# Altium project Board 3.PrjPcb
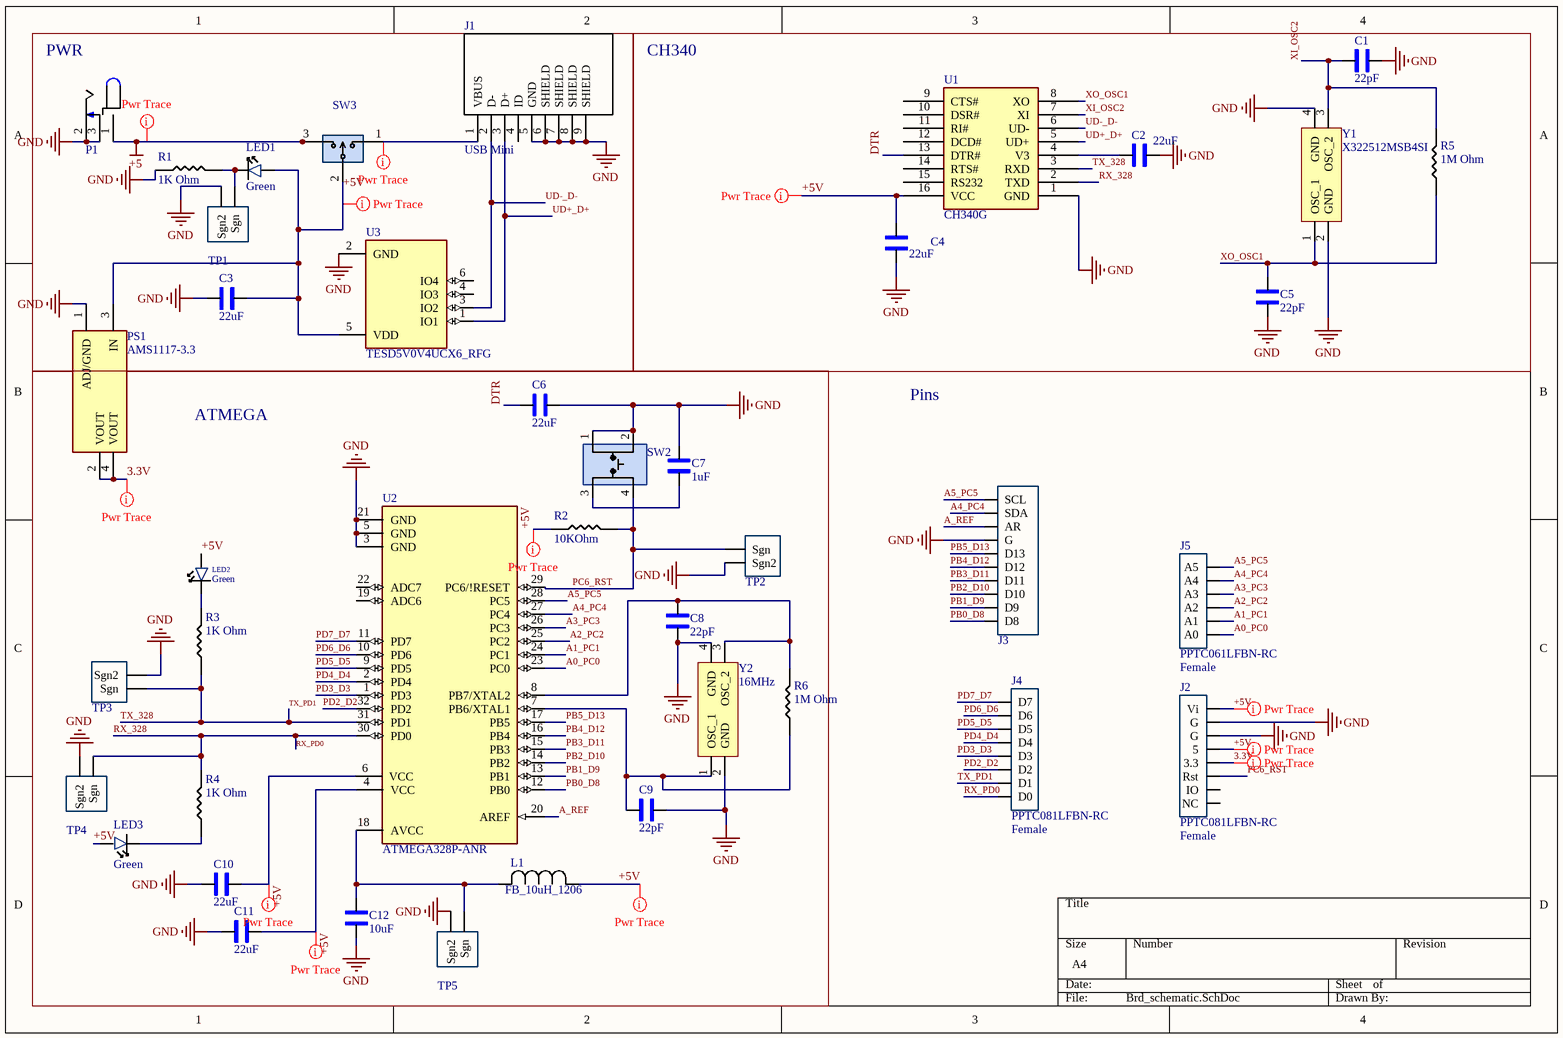
[diagram p0: Brd_schematic.SchDoc]
1 sheet, 41 parts. Net scope: global (net labels, ports and power ports of the same name join across sheets).
Board file: brd3_layout.PcbDoc

## Sheet Brd_schematic.SchDoc
size A4; SheetNumber: 1; SheetTotal: 1

### Parts
C1  22pF  [1206_Passive_Capacitor]
C2  22uF  [1206_Passive_Capacitor]
C3  22uF  [1206_Passive_Capacitor]
C4  22uF  [1206_Passive_Capacitor]
C5  22pF  [1206_Passive_Capacitor]
C6  22uF  [1206_Passive_Capacitor]
C7  1uF  [1206_Passive_Capacitor]
C8  22pF  [1206_Passive_Capacitor]
C9  22pF  [1206_Passive_Capacitor]
C10  22uF  [1206_Passive_Capacitor]
C11  22uF  [1206_Passive_Capacitor]
C12  10uF  [1206_Passive_Capacitor]
J1  USB Mini  [USB_MINI_B]
J2  PPTC081LFBN-RC  value Female  [8_PIN_ARD-PWR_100MIL]
J3  PPTC101LFBN-RC  [10_PIN_ARDUINO_100MIL]  (value not drawn)
J4  PPTC081LFBN-RC  value Female  [8_PIN_ARD-DIG_100MIL]
J5  PPTC061LFBN-RC  value Female  [6_PIN_ARD-Analog_100mil]
L1  FB_10uH_1206  [AIML-1206_ABR-M]
LED1  Green  [LED_1206]
LED2  Green  [LED_1206]
LED3  Green  [LED_1206]
P1  Power Jack  [Power_Jack]  (value not drawn)
PS1  AMS1117-3.3  [LDO]
R1  value 1K Ohm  [1206_Passive_Resitor]  (hidden comment: 1k)
R2  value 10KOhm  [1206_Passive_Resitor]  (hidden comment: 10k)
R3  value 1K Ohm  [1206_Passive_Resitor]  (hidden comment: 1k)
R4  value 1K Ohm  [1206_Passive_Resitor]  (hidden comment: 1k)
R5  value 1M Ohm  [1206_Passive_Resitor]  (hidden comment: 1M)
R6  value 1M Ohm  [1206_Passive_Resitor]  (hidden comment: 1M)
SW2  TL3305AF160QG  [Switch_JLC]  (value not drawn)
SW3  PREC003SAAN-RC  [3_PIN_100mil]  (value not drawn)
TP1  10x Probe TP  [TP_Diff_Probe]  (value not drawn)
TP2  10x Probe TP  [TP_Diff_Probe]  (value not drawn)
TP3  10x Probe TP  [TP_Diff_Probe]  (value not drawn)
TP4  10x Probe TP  [TP_Diff_Probe]  (value not drawn)
TP5  10x Probe TP  [TP_Diff_Probe]  (value not drawn)
U1  CH340G  [USB to serial]
U2  ATMEGA328P-ANR  [ATMega328P]
U3  TESD5V0V4UCX6_RFG  [SOT95P280X145-6N]
Y1  X322512MSB4SI  [Crystal resonator]
Y2  value 16MHz  [Crystal resonator]  (hidden comment: X322516MLB4SI)

### Blocks framed on the sheet
PWR: C3 J1 LED1 P1 R1 SW3 TP1 U3
CH340: C1 C2 C4 C5 R5 U1 Y1
ATMEGA: C6-C12 L1 LED2 LED3 PS1 R2-R4 R6 SW2 TP2-TP5 U2 Y2

### Nets
+5: P1.1 SW3.3
GND: C1.1 C2.1 C3.1 C4.1 C5.2 C6.2 C7.2 C8.1 C9.1 C10.1 C11.1 C12.1 J1.5(GND) J1.6(SHIELD) J1.7(SHIELD) J1.8(SHIELD) J1.9(SHIELD) J2.6(G) J2.7(G) J3.4(G) P1.2 P1.3 PS1.1(ADJ/GND) R1.1 SW2.1 SW2.2 TP1.2(Sgn2) TP2.2(Sgn2) TP3.2(Sgn2) TP4.2(Sgn2) TP5.2(Sgn2) U1.1(GND) U2.3(GND) U2.5(GND) U2.21(GND) U3.2(GND) Y1.2(GND) Y1.4(GND) Y2.2(GND) Y2.4(GND)
3.3V: J2.4(3.3) PS1.2(VOUT) PS1.4(VOUT)
+5V: C3.2 C4.2 C10.2 C11.2 J2.5 J2.8(Vi) L1.1 LED1.1 LED2.1 LED3.1 PS1.3(IN) R2.1 SW3.2 U1.16(VCC) U2.4(VCC) U2.6(VCC) U3.5(VDD)
A0_PC0: J5.1(A0) U2.23(PC0)
A1_PC1: J5.2(A1) U2.24(PC1)
A2_PC2: J5.3(A2) U2.25(PC2)
A3_PC3: J5.4(A3) U2.26(PC3)
A4_PC4: J3.2(SDA) J5.5(A4) U2.27(PC4)
A5_PC5: J3.1(SCL) J5.6(A5) U2.28(PC5)
A_REF: J3.3(AR) U2.20(AREF)
DTR: C6.1 U1.13(DTR#)
PB0_D8: J3.10(D8) U2.12(PB0)
PB1_D9: J3.9(D9) U2.13(PB1)
PB2_D10: J3.8(D10) U2.14(PB2)
PB3_D11: J3.7(D11) U2.15(PB3)
PB4_D12: J3.6(D12) U2.16(PB4)
PB5_D13: J3.5(D13) U2.17(PB5)
PC6_RST: J2.3(Rst) R2.2 SW2.4 TP2.1(Sgn) U2.29(PC6/!RESET)
PD2_D2: J4.6(D2) U2.32(PD2)
PD3_D3: J4.5(D3) U2.1(PD3)
PD4_D4: J4.4(D4) U2.2(PD4)
PD5_D5: J4.3(D5) U2.9(PD5)
PD6_D6: J4.2(D6) U2.10(PD6)
PD7_D7: J4.1(D7) U2.11(PD7)
RX_328: J4.8(D0) R4.2 TP4.1(Sgn) U1.2(TXD) U2.30(PD0)  [also labelled RX_PD0]
TX_328: J4.7(D1) R3.1 TP3.1(Sgn) U1.3(RXD) U2.31(PD1)  [also labelled TX_PD1]
UD+_D+: J1.3(D+) U1.5(UD+) U3.1(IO1)
UD-_D-: J1.2(D-) U1.6(UD-) U3.3(IO2)
XI_OSC2: C1.2 R5.2 U1.7(XI) Y1.3(OSC_2)
XO_OSC1: C5.1 R5.1 U1.8(XO) Y1.1(OSC_1)
NetC2_2: C2.2 U1.4(V3)
NetC7_1: C7.1 SW2.3
NetC8_2: C8.2 R6.2 U2.8(PB7/XTAL2) Y2.3(OSC_2)
NetC9_2: C9.2 R6.1 U2.7(PB6/XTAL1) Y2.1(OSC_1)
NetC12_2: C12.2 L1.2 TP5.1(Sgn) U2.18(AVCC)
NetJ1_1: J1.1(VBUS) SW3.1
NetLED1_2: LED1.2 R1.2 TP1.1(Sgn)
NetLED2_2: LED2.2 R3.2
NetLED3_2: LED3.2 R4.1

Not connected (* = marked no-connect by the designer): J1 4(ID); J2 1(NC) 2(IO); U1 9(CTS#) 10(DSR#) 11(RI#) 12(DCD#) 14(RTS#) 15(RS232); U2 19(ADC6) 22(ADC7); U3 4(IO3) 6(IO4)

### Layout directives
rule Width Constraint [Pref Width = 20mil    Min Width = 10mil    Max Width = 100mil]: 3.3V, +5, +5V, NetJ1_1

### Notes on the sheet
- Pins

### Library data of the parts
C1 C5 C8 C9 = C_22pF_1206: 22pF ±5% 1kV C0G 1206 Multilayer Ceramic Capacitors MLCC - SMD/SMT RoHS; MFR Part #: CC1206JKNPOCBN220; Type: Extended; LCSC Part#: C107174; Datasheet: https://datasheet.lcsc.com/lcsc/1810241219_YAGEO-CC1206JKNPOCBN220_C107174.pdf; Value: 22pF
C2-C4 C6 C10 C11 = C_22uF_1206: 22uF ±10% 25V X5R 1206 Multilayer Ceramic Capacitors MLCC - SMD/SMT RoHS; MFR Part #: CL31A226KAHNNNE; Type: basic; LCSC Part#: C12891; Datasheet: https://datasheet.lcsc.com/lcsc/1811031514_Samsung-Electro-Mechanics-CL31A226KAHNNNE_C12891.pdf; Value: 22uF
C7 = C_1uF_1206: MULTILAYER CERAMIC CAPACITORS MLCC - SMD/SMT 1UF 50V 1206 ROHS; MFR Part #: CL31B105KBHNNNE; Type: Basic; Digikey Link: https://www.digikey.com/product-detail/en/C1206C105M4RACTU/399-8150-1-ND/3471873/?itemSeq=304982366; LCSC Part#: C1848; Value: 1uF
C12 = C_10uF_1206: 10uF ±10% 50V X5R 1206 Multilayer Ceramic Capacitors MLCC - SMD/SMT RoHS; MFR Part #: CL31A106KBHNNNE; Type: Basic; LCSC Part#: C13585; Datasheet: https://datasheet.lcsc.com/lcsc/1810221112_Samsung-Electro-Mechanics-CL31A106KBHNNNE_C13585.pdf; Value: 10uF
J1 = J_USB_B_Mini: Through Hole USB Connectors RoHS; MFR Part #: 920-462A2021D10102; Value: USB mini B; LCSC Part#: C46398; Datasheet: https://datasheet.lcsc.com/szlcsc/2103081233_Jing-Extension-of-the-Electronic-Co-920-462A2021D10102_C46398.pdf; Type: Extended
J2 = JF_8_PIN_FEMA_ARD-Pwr: 8 Position Header Connector 0.100" (2.54mm) Through Hole Tin; Digikey Link: https://www.digikey.com/product-detail/en/PPTC081LFBN-RC/S7006-ND/810147/?itemSeq=304982354; MFR Part #: PPTC081LFBN-RC; Type: Extended; LCSC Part#: C27438
J3 = JF_10_PIN_FEMA_ARDUINO: 10 Position Header Connector 0.100" (2.54mm) Through Hole Tin; Value: Female; Digikey Link: https://www.digikey.com/product-detail/en/PPTC101LFBN-RC/S7008-ND/810149/?itemSeq=304982352; MFR Part #: PPTC101LFBN-RC; LCSC Part#: C225507; Type: Extended
J4 = JF_8_PIN_FEMA_ARD-Dig: 8 Position Header Connector 0.100" (2.54mm) Through Hole Tin; Digikey Link: https://www.digikey.com/product-detail/en/PPTC081LFBN-RC/S7006-ND/810147/?itemSeq=304982354; MFR Part #: PPTC081LFBN-RC; Type: Extended; LCSC Part#: C27438
J5 = JF_6_PIN_FEMA_ARD-Anolog: 6 Position Header Connector 0.100" (2.54mm) Through Hole Tin; Digikey Link: https://www.digikey.com/product-detail/en/PPTC061LFBN-RC/S7004-ND/810145/?itemSeq=304982353; MFR Part #: PPTC061LFBN-RC; LCSC Part#: C40877; Type: Extended
L1 = FB_10uH_1206: 25mA 10uH ±10% 800mΩ 1206  Inductors (SMD) ROHS; Mfr_Name: FH (Guangdong Fenghua Advanced Tech); MFR PART #: CMI321609X100KT; Type: Basic; LCSC PART#: C1051; DataSheet: https://datasheet.lcsc.com/lcsc/1810311314_FH--Guangdong-Fenghua-Advanced-Tech-CMI321609X100KT_C1051.pdf
LED1-LED3 = LED_GREEN_1206: Green 513~528nm 1206 Light Emitting Diodes (LED) RoHS; MFR Part #: SZYY1206G; Type: Extended; LCSC Part#: C434439; Datasheet: https://datasheet.lcsc.com/lcsc/2006301532_Yongyu-Photoelectric-SZYY1206G_C434439.pdf; Value: Green
P1 = P_Power Jack: Power Barrel Connector Jack 2.10mm ID (0.083"), 5.50mm OD (0.217") Through Hole, Right Angle; MFR Part #: PJ-102A; Value: CONN PWR JACK 2X5.5MM SOLDER; Digikey Link: https://www.digikey.com/product-detail/en/PJ-102A/CP-102A-ND/275425/?itemSeq=304982367; LCSC Part#: C136744; Type: Extended
PS1 = PS_AMS_LDO_3v3: LOW DROPOUT REGULATORS(LDO) POSITIVE FIXED 1.3V @ 800MA 15V 3.3V 1A SOT-223 ROHS; Value: IC REG LINEAR 3.3V 800MA SOT223; MFR Part #: AMS1117-3.3; LCSC Part#: C6186; Type: Basic
R1 R3 R4 = R_1K_1206: CHIP RESISTOR - SURFACE MOUNT 1KOHMS ±1% 1/4W 1206 ROHS; MFR Part #: RNCP1206FTD1K00CT; Digikey Link: https://www.digikey.com/product-detail/en/RNCP1206FTD1K00/RNCP1206FTD1K00CT-ND/2240675/?itemSeq=304982373; LCSC Part#: C4410; Type: Basic
R2 = R_10KOhm_1206: 10 kOhms ±5% 0.25W, 1/4W Chip Resistor 1206 (3216 Metric) Automotive AEC-Q200 Thick Film; MFR Part #: RMCF1206FT10K0; Digikey Link: https://www.digikey.com/en/products/detail/stackpole-electronics-inc/RMCF1206FT10K0/1759669; LCSC Part#: C17902; Type: Basic
R5 R6 = R_1M_1206: CHIP RESISTOR - SURFACE MOUNT 1MOHMS ±1% 1/4W 1206 ROHS; MFR Part #: RMCF1206JT1M00; Digikey Link: https://www.digikey.com/product-detail/en/RMCF1206JT1M00/RMCF1206JT1M00CT-ND/1942830/?itemSeq=304982358; LCSC Part#: C17927; Type: Basic
SW2 = SW_Push_Button_JLC: Tactile Switch SPST-NO Top Actuated Surface Mount; MFR Part #: KH-4.5X4.5X4.3H-STM; LCSC Part#: C2837550; Type: Extended; DataSheet: https://datasheet.lcsc.com/lcsc/2106081532_Shenzhen-Kinghelm-Elec-KH-4.5X4.5X4.3H-STM_C2837550.pdf
SW3 = SW_3Pin_100mil_Switch: Connector Header Through Hole 3 position 0.100" (2.54mm); Value: CONN HEADER VERT 3POS 2.54MM; Digikey Link: https://www.digikey.com/product-detail/en/PREC003SAAN-RC/S1012EC-03-ND/2774851/?itemSeq=304982371; MFR Part #: PREC003SAAN-RC; Type: Extended; LCSC Part#: C49257
TP1-TP5 = TP_Diff_Probe: Test Point 300 mil centers
U1 = U_USBtoSerial: Transceiver USB 2.0 2Mbps SOP-16_150mil USB ICs RoHS; Datasheet: https://datasheet.lcsc.com/lcsc/2008191806_WCH-Jiangsu-Qin-Heng-CH340G_C14267.pdf; LCSC Part#: C14267; MFR Part #: CH340G; Type: Basic; Value: USB to Serial
U2 = U_ATMega328P: AVR AVR® ATmega Microcontroller IC 8-Bit 20MHz 32KB (16K x 16) FLASH 32-TQFP (7x7); MFR Part #: ATMEGA328P-AU; Value: IC MCU 8BIT 32KB FLASH 32TQFP; Digikey Link: https://www.digikey.com/product-detail/en/ATMEGA328P-ANR/ATMEGA328P-ANRCT-ND/2774230/?itemSeq=304982365; LCSC Part#: C14877; Type: Basic
U3 = TESD5V0V4UCX6_RFG: SOT-26, 5V, 75W, 0.6pF, ESD Protection; MF: Taiwan Semiconductor; MP: TESD5V0V4UCX6 RFG; SnapEDA_Link: https://www.snapeda.com/parts/TESD5V0V4UCX6%20RFG/Taiwan+Semiconductor/view-part/?ref=snap; Package: None; Value: *; Check_prices: https://www.snapeda.com/parts/TESD5V0V4UCX6%20RFG/Taiwan+Semiconductor/view-part/?ref=eda
Y1 = X_12MHz_Res: SMD Crystal Resonators 12MHz ±10ppm SMD-3225_4P RoHS; LCSC Part#: C9002; MFR Part #: X322512MSB4SI; Value: 12MHz; Type: Basic; Datasheet: https://datasheet.lcsc.com/szlcsc/Yangxing-Tech-X322512MSB4SI_C9002.pdf
Y2 = X_16Mhz_Res: ±10ppm 16000000Hz -40℃~85℃ 贴片无源晶振 60Ω 9pF SMD3225-4P Crystals ROHS; LCSC Part#: C13738; MFR Part #: X322516MLB4SI; Type: Basic